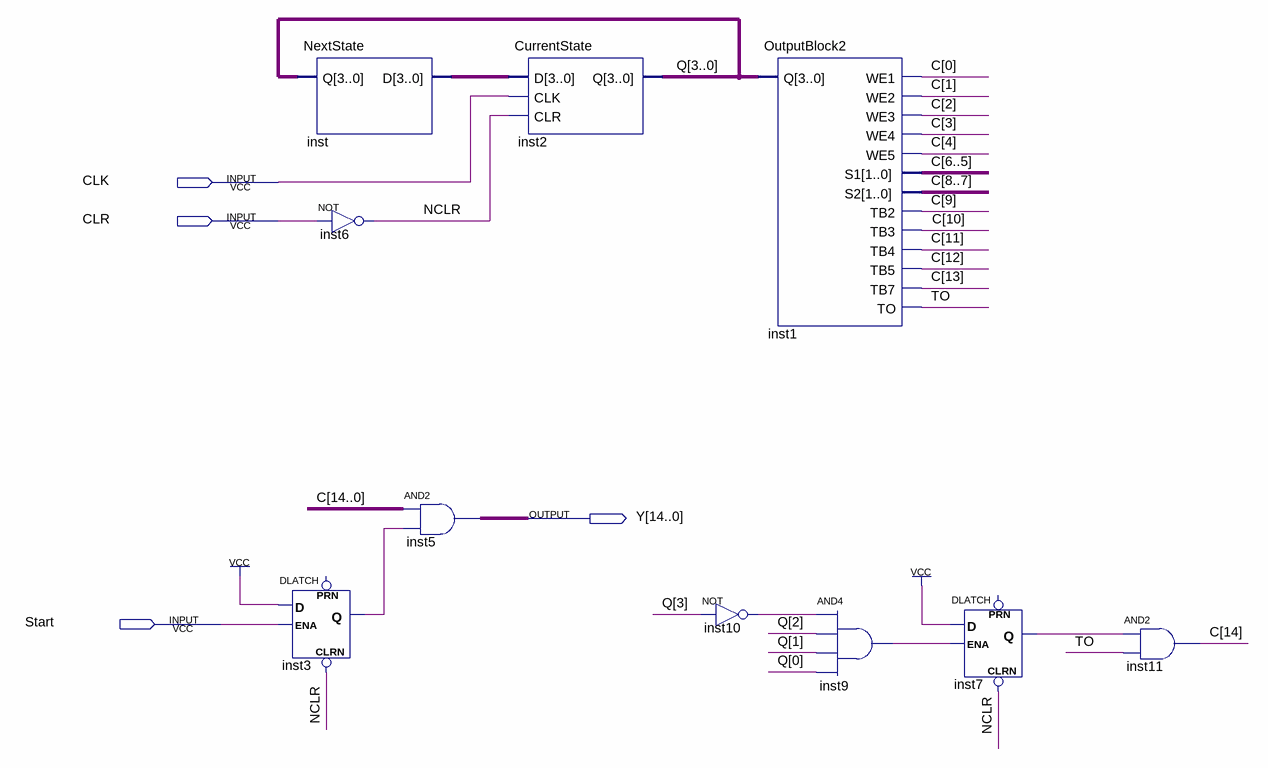
[diagram p0: schematic sheet]
// Quartus schematic Control2.bdf as structural Verilog: 10 symbols, 4 pins
module Control2 (
  input  CLK,
  input  CLR,
  input  Start,
  output [14:0] Y
);

  wire inst3_q, inst7_q, inst9_out, inst10_out, NCLR, TO;
  wire [3:0] inst_d, Q;
  wire [14:0] C;

  NextState inst (.Q(Q), .D(inst_d));
  DLATCH inst3 (.CLRN(NCLR), .D(1'b1), .ENA(Start), .Q(inst3_q));  // open: PRN
  not inst6 (NCLR, CLR);
  assign Y = C & {15{inst3_q}};  // AND2 inst5, 15 bits wide
  CurrentState inst2 (.D(inst_d), .CLK(CLK), .CLR(NCLR), .Q(Q));
  OutputBlock2 inst1 (
    .Q(Q), .WE1(C[0]), .WE2(C[1]), .WE3(C[2]), .WE4(C[3]), .WE5(C[4]), .S1(C[6:5]), .S2(C[8:7]), .TB2(C[9]),
    .TB3(C[10]), .TB4(C[11]), .TB5(C[12]), .TB7(C[13]), .TO(TO));
  not inst10 (inst10_out, Q[3]);
  and inst9 (inst9_out, inst10_out, Q[2], Q[1], Q[0]);
  DLATCH inst7 (.CLRN(NCLR), .D(1'b1), .ENA(inst9_out), .Q(inst7_q));  // open: PRN
  and inst11 (C[14], inst7_q, TO);
endmodule
